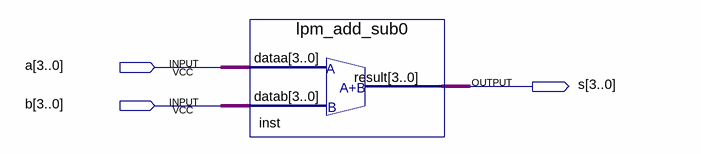
[diagram p0: schematic sheet]
// Quartus schematic lab3.bdf as structural Verilog: 1 symbols, 3 pins
module lab3 (
  input  [3:0] a,
  input  [3:0] b,
  output [3:0] s
);

  lpm_add_sub0 inst (.dataa(a), .datab(b), .result(s));
endmodule
